# Altium schematic sheet driver.SchDoc
size A3; SheetNumber: 2; SheetTotal: 2
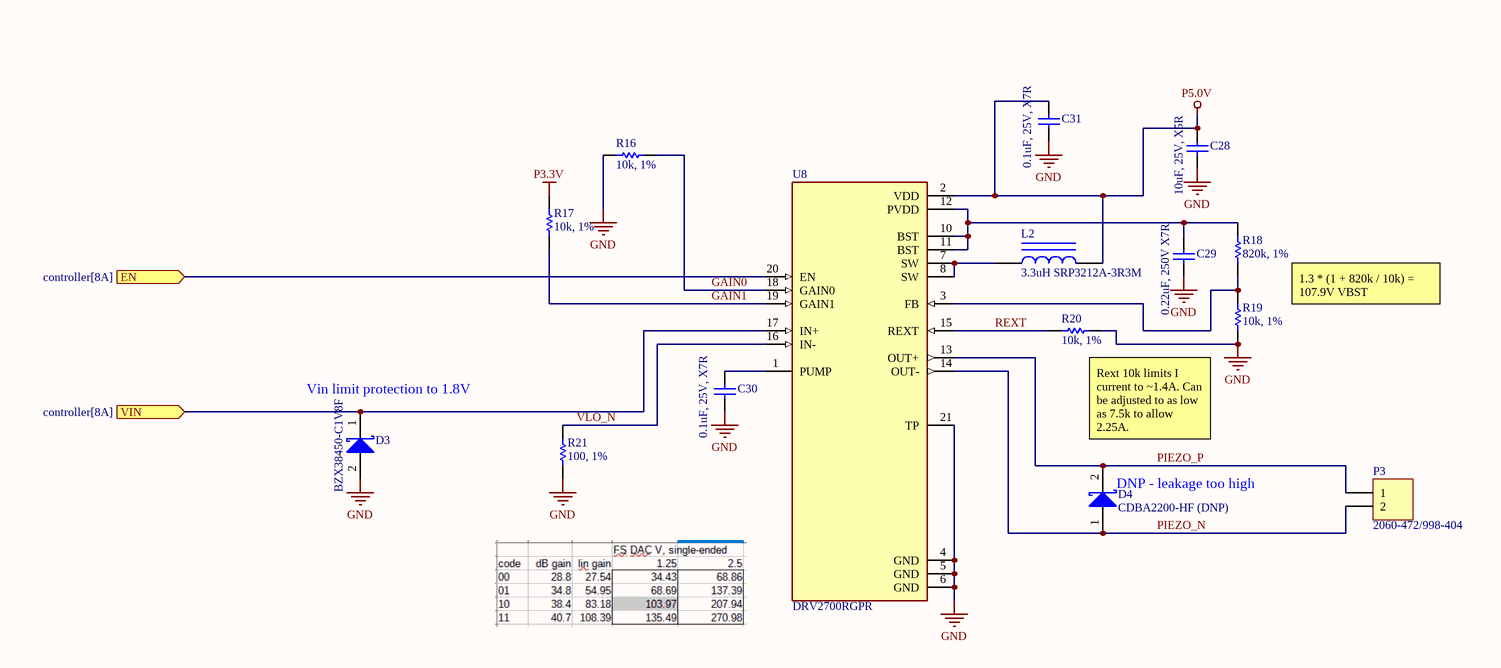
[diagram p0: driver.SchDoc]

## Parts
C28  10uF, 25V, X5R  [B_CAP0805]
C29  0.22uF, 250V X7R  [B_CAP1210]
C30  0.1uF, 25V, X7R  [B_CAP0603]
C31  0.1uF, 25V, X7R  [B_CAP0603]
D3  BZX38450-C1V8F  [SOD-323]
D4  CDBA2200-HF (DNP)  [DSO-C2/X1.8]
L2  3.3uH SRP3212A-3R3M  [B_IND1210_BOURNES]
P3  2060-472/998-404  [WAGO_2060-472/998-404]
R16  10k, 1%  [B_RES0603]
R17  10k, 1%  [B_RES0603]
R18  820k, 1%  [B_RES0603]
R19  10k, 1%  [B_RES0603]
R20  10k, 1%  [B_RES0603]
R21  100, 1%  [B_RES0603]
U8  DRV2700RGPR  [QFN50P400X400X100_HS-21N_DRV2700]

## Ports
EN (in, see controller[8A]), VIN (in, see controller[8A])

## Nets
GND: C28.2 C29.2 C30.2 C31.2 D3.2(A) R16.2 R19.1 R20.2 R21.2 U8.4(GND) U8.5(GND) U8.6(GND) U8.21(TP)
P3.3V: R17.1
P5.0V: C28.1 C31.1 L2.2 U8.2(VDD)
EN: U8.20(EN) ; port EN
GAIN0: R16.1 U8.18(GAIN0)
GAIN1: R17.2 U8.19(GAIN1)
PIEZO_N: D4.1(A) P3.2 U8.14(OUT-)
PIEZO_P: D4.2(K) P3.1 U8.13(OUT+)
REXT: R20.1 U8.15(REXT)
VIN: D3.1(K) U8.17(IN+) ; port VIN
VLO_N: R21.1 U8.16(IN-)
NetC29_1: C29.1 R18.2 U8.10(BST) U8.11(BST) U8.12(PVDD)
NetC30_1: C30.1 U8.1(PUMP)
NetL2_1: L2.1 U8.7(SW) U8.8(SW)
NetR18_1: R18.1 R19.2 U8.3(FB)

## Notes on the sheet
- 1.3 * (1 + 820k / 10k) = 107.9V VBST
- (near D3) Vin limit protection to 1.8V
- Rext 10k limits I current to ~1.4A. Can be adjusted to as low as 7.5k to allow 2.25A.
- (near D4) DNP - leakage too high

## Library data of the parts
C28 = Cap Semi: Capacitor (Semiconductor SIM Model); MPN: GRM21BR61E106KA73L; VENDOR: Murata; MYPN: C-106-25-X5R-0805
C29 = Cap Semi: Capacitor (Semiconductor SIM Model); MPN: GCJ32DR72E224KXJ1L; VENDOR: Murata; MYPN: C-224-250-X7R-1210
C30 C31 = Cap Semi: Capacitor (Semiconductor SIM Model); MPN: CC0603KRX7R8BB104; VENDOR: Murata; MYPN: C-104-25-X7R-0603
D3 = D Schottky: Schottky Diode; VENDOR: Nexperia; MYPN: D-Z-1p8-SOD323; Revision: July-2002: Re-released for DXP Platform.; MPN: BZX38450-C1V8F
D4 = D Schottky: Schottky Diode; VENDOR: Comchip; MYPN: D-S-2-200-0p9-SMA; Revision: July-2002: Re-released for DXP Platform.; MPN: DNP
L2 = Inductor Iron: Magnetic-Core Inductor; VENDOR: Bournes; MYPN: L-SRP3212A-3R3M; MPN: SRP3212A-3R3M
P3 = Header 2: Header, 2-Pin; VENDOR: WAGO; MYPN: J-TB-2P-5.08; LatestRevisionDate: 17-Jul-2002; LatestRevisionNote: Re-released for DXP Platform.; Publisher: Altium Limited; MPN: 2060-472/998-404
R16 R17 R20 = Res1: Resistor; MPN: RC0603FR-0710KL; VENDOR: Yageo; MYPN: R-103-1P-1_16W-0603
R18 = Res1: Resistor; MPN: RC0603FR-07820KL; VENDOR: Yageo; MYPN: R-820K-1P-1_10W-0603
R19 = Res1: Resistor; MPN: RC0603FR-0710KL; VENDOR: Yageo; MYPN: R-10K-1P-1_10W-0603
R21 = Res1: Resistor; VENDOR: ANY; MYPN: R-101-1P-1_16W-0603; MPN: ANY
U8 = DRV2700RGPR: Motor Driver Analog 20-QFN _4x4_; MPN: DRV2700RGP(T/R); MF: Texas Instruments; VENDOR: TI; SnapEDA_Link: https://www.snapeda.com/parts/DRV2700RGPR/Texas%20Instruments/view-part/1065208/?ref=snap; Availability: Unavailable; Value: *; Package: VFQFN-20 Texas Instruments; Price: None; MP: DRV2700RGPR